# EAGLE design HumidTempSleep_Feather_001 (EAGLE 9.5.1)
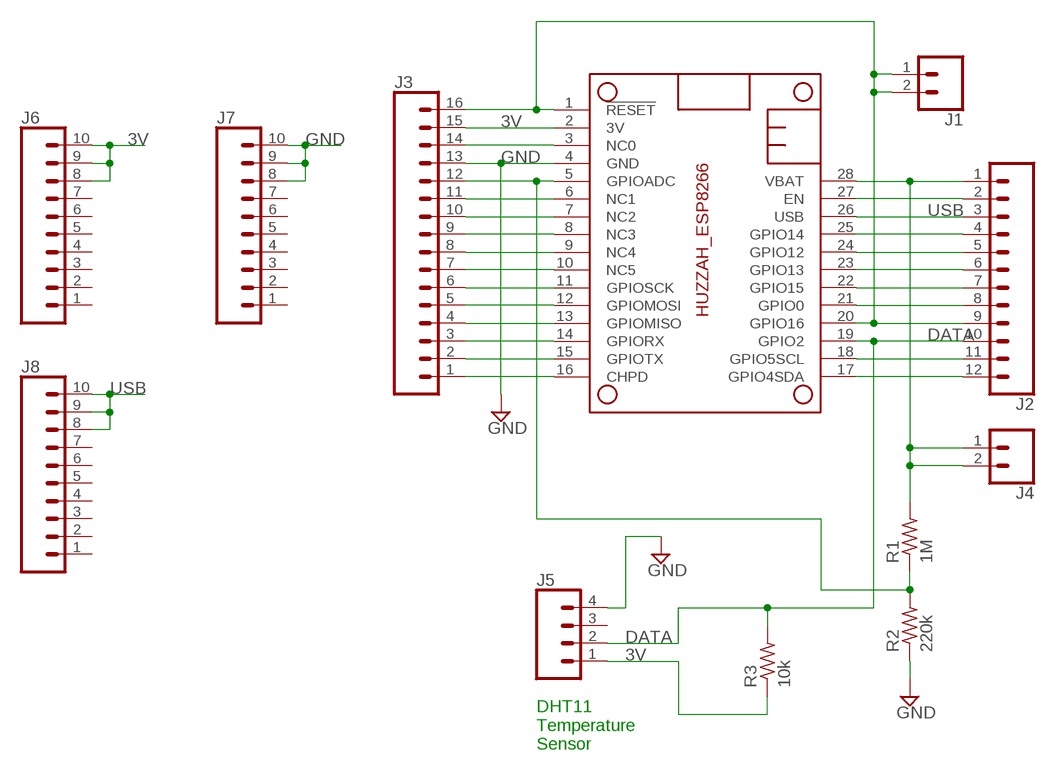
[diagram p0: schematic, sheet 1]

## Parts
J1  CONN_02  [1X02]
J2  CONN_12  [1X12]
J3  CONN_16  [1X16]
J4  CONN_02  [1X02]
J5  CONN_04PTH  [1X04]
J6  CONN_10"  [1X10]
J7  CONN_10"  [1X10]
J8  CONN_10"  [1X10]
MS2  FEATHERWING  [FEATHERWING]
R1  1M  R-US_R0805  [R0805]
R2  220k  R-US_R0805  [R0805]
R3  10k  R-US_R0805  [R0805]

## Nets
3V: J3.15 J5.1 J6.8 J6.9 J6.10 MS2.2(3V) R3.1
DATA: J2.10 J5.2 MS2.19(GPIO2) R3.2
GND: J3.13 J5.4 J7.8 J7.9 J7.10 MS2.4(GND) R2.1
N$1: J1.1 J1.2 J2.9 J3.16 MS2.1(!RESET) MS2.20(GPIO16)
N$2: J2.2 MS2.27(EN)
N$4: J2.4 MS2.25(GPIO14)
N$5: J2.5 MS2.24(GPIO12)
N$6: J2.6 MS2.23(GPIO13)
N$7: J2.7 MS2.22(GPIO15)
N$8: J2.8 MS2.21(GPIO0)
N$10: J2.11 MS2.18(GPIO5SCL)
N$11: J2.12 MS2.17(GPIO4SDA)
N$12: J3.14 MS2.3(NC0)
N$13: J3.11 MS2.6(NC1)
N$14: J3.10 MS2.7(NC2)
N$15: J3.9 MS2.8(NC3)
N$16: J3.8 MS2.9(NC4)
N$17: J3.7 MS2.10(NC5)
N$18: J3.6 MS2.11(GPIOSCK)
N$19: J3.5 MS2.12(GPIOMOSI)
N$20: J3.4 MS2.13(GPIOMISO)
N$21: J3.3 MS2.14(GPIORX)
N$22: J3.2 MS2.15(GPIOTX)
N$23: J3.1 MS2.16(CHPD)
N$24: J3.12 MS2.5(GPIOADC) R1.1 R2.2
USB: J2.3 J8.8 J8.9 J8.10 MS2.26(USB)
VBAT: J2.1 J4.1 J4.2 MS2.28(VBAT) R1.2
Unconnected: J5.3 J6.1 J6.2 J6.3 J6.4 J6.5 J6.6 J6.7 J7.1 J7.2 J7.3 J7.4 J7.5 J7.6 J7.7 J8.1 J8.2 J8.3 J8.4 J8.5 J8.6 J8.7

## Notes on the sheet
- DHT11
  Temperature
  Sensor

## Library data of the parts
J1 J4 = SparkFun-Connectors:CONN_02: Multi connection point. Often used as Generic Header-pin footprint for 0.1 inch spaced/style header connections On any of the 0.1 inch spaced packages, you can populate with these: Break Away Headers - Straight <https://www.sparkfun.com/products/116> (PRT-00116) Break Away Male Headers - Right Angle <https://www.sparkfun.com/products/553> (PRT-00553) Female Headers <https://www.sparkfun.com/products/115> (PRT-00115) Break Away Headers - Machine Pin <https://www.sparkfun.com/products/117> (PRT-00117) Break Away Female Headers - Swiss Machine Pin <https://www.sparkfun.com/products/743> (PRT-00743) For SCREWTERMINALS and SPRING TERMINALS visit here: Screw Terimnals on SparkFun.com <https://www.sparkfun.com/search/results?term=Screw+Terminals> (5mm/3.5mm/2.54mm spacing) This device is also useful as a general connection point to wire up your design to another part of your project. Our various solder wires solder well into these plated through hole pads. Hook-Up Wire - Assortment (Stranded, 22 AWG) <https://www.sparkfun.com/products/11375> (PRT-11375) Hook-Up Wire - Assortment (Solid Core, 22 AWG) <https://www.sparkfun.com/products/11367> (PRT-11367) View the entire wire category on our website here <https://www.sparkfun.com/categories/141> Special notes: Molex polarized connector foot print use with: PRT-08233 with associated crimp pins and housings. 2.54_SCREWTERM for use with PRT-10571. 3.5mm Screw Terminal footprints for PRT-08084 5mm Screw Terminal footprints for use with PRT-08432
J2 = SparkFun-Connectors:CONN_12: Multi connection point. Often used as Generic Header-pin footprint for 0.1 inch spaced/style header connections On any of the 0.1 inch spaced packages, you can populate with these: Break Away Headers - Straight <https://www.sparkfun.com/products/116> (PRT-00116) Break Away Male Headers - Right Angle <https://www.sparkfun.com/products/553> (PRT-00553) Female Headers <https://www.sparkfun.com/products/115> (PRT-00115) Break Away Headers - Machine Pin <https://www.sparkfun.com/products/117> (PRT-00117) Break Away Female Headers - Swiss Machine Pin <https://www.sparkfun.com/products/743> (PRT-00743) For SCREWTERMINALS and SPRING TERMINALS visit here: Screw Terimnals on SparkFun.com <https://www.sparkfun.com/search/results?term=Screw+Terminals> (5mm/3.5mm/2.54mm spacing) This device is also useful as a general connection point to wire up your design to another part of your project. Our various solder wires solder well into these plated through hole pads. Hook-Up Wire - Assortment (Stranded, 22 AWG) <https://www.sparkfun.com/products/11375> (PRT-11375) Hook-Up Wire - Assortment (Solid Core, 22 AWG) <https://www.sparkfun.com/products/11367> (PRT-11367) View the entire wire category on our website here <https://www.sparkfun.com/categories/141> Special notes: Molex polarized connector foot print use with SKU : PRT-08231 with associated crimp pins and housings. 1MM SMD Version SKU: PRT-10208 NOTES ON THE VARIANTS LOCK and LOCK_LONGPADS... This footprint was designed to help hold the alignment of a through-hole component (i.e. 6-pin header) while soldering it into place. You may notice that each hole has been shifted either up or down by 0.005 of an inch from it's more standard position (which is a perfectly straight line). This slight alteration caused the pins (the squares in the middle) to touch the edges of the holes. Because they are alternating, it causes a "brace" to hold the component in place. 0.005 has proven to be the perfect amount of "off-center" position when using our standard breakaway headers. Although looks a little odd when you look at the bare footprint, once you have a header in there, the alteration is very hard to notice. Also,if you push a header all the way into place, it is covered up entirely on the bottom side.
J3 = SparkFun-Connectors:CONN_16: Multi connection point. Often used as Generic Header-pin footprint for 0.1 inch spaced/style header connections On any of the 0.1 inch spaced packages, you can populate with these: Break Away Headers - Straight <https://www.sparkfun.com/products/116> (PRT-00116) Break Away Male Headers - Right Angle <https://www.sparkfun.com/products/553> (PRT-00553) Female Headers <https://www.sparkfun.com/products/115> (PRT-00115) Break Away Headers - Machine Pin <https://www.sparkfun.com/products/117> (PRT-00117) Break Away Female Headers - Swiss Machine Pin <https://www.sparkfun.com/products/743> (PRT-00743) For SCREWTERMINALS and SPRING TERMINALS visit here: Screw Terimnals on SparkFun.com <https://www.sparkfun.com/search/results?term=Screw+Terminals> (5mm/3.5mm/2.54mm spacing) This device is also useful as a general connection point to wire up your design to another part of your project. Our various solder wires solder well into these plated through hole pads. Hook-Up Wire - Assortment (Stranded, 22 AWG) <https://www.sparkfun.com/products/11375> (PRT-11375) Hook-Up Wire - Assortment (Solid Core, 22 AWG) <https://www.sparkfun.com/products/11367> (PRT-11367) View the entire wire category on our website here <https://www.sparkfun.com/categories/141> Special notes: Molex polarized connector foot print use with SKU : PRT-08231 with associated crimp pins and housings. 1MM SMD Version SKU: PRT-10208 NOTES ON THE VARIANTS LOCK and LOCK_LONGPADS... This footprint was designed to help hold the alignment of a through-hole component (i.e. 6-pin header) while soldering it into place. You may notice that each hole has been shifted either up or down by 0.005 of an inch from it's more standard position (which is a perfectly straight line). This slight alteration caused the pins (the squares in the middle) to touch the edges of the holes. Because they are alternating, it causes a "brace" to hold the component in place. 0.005 has proven to be the perfect amount of "off-center" position when using our standard breakaway headers. Although looks a little odd when you look at the bare footprint, once you have a header in there, the alteration is very hard to notice. Also,if you push a header all the way into place, it is covered up entirely on the bottom side.
J5 = SparkFun-Connectors:CONN_04: Multi connection point. Often used as Generic Header-pin footprint for 0.1 inch spaced/style header connections On any of the 0.1 inch spaced packages, you can populate with these: Break Away Headers - Straight <https://www.sparkfun.com/products/116> (PRT-00116) Break Away Male Headers - Right Angle <https://www.sparkfun.com/products/553> (PRT-00553) Female Headers <https://www.sparkfun.com/products/115> (PRT-00115) Break Away Headers - Machine Pin <https://www.sparkfun.com/products/117> (PRT-00117) Break Away Female Headers - Swiss Machine Pin <https://www.sparkfun.com/products/743> (PRT-00743) For SCREWTERMINALS and SPRING TERMINALS visit here: Screw Terimnals on SparkFun.com <https://www.sparkfun.com/search/results?term=Screw+Terminals> (5mm/3.5mm/2.54mm spacing) This device is also useful as a general connection point to wire up your design to another part of your project. Our various solder wires solder well into these plated through hole pads. Hook-Up Wire - Assortment (Stranded, 22 AWG) <https://www.sparkfun.com/products/11375> (PRT-11375) Hook-Up Wire - Assortment (Solid Core, 22 AWG) <https://www.sparkfun.com/products/11367> (PRT-11367) View the entire wire category on our website here <https://www.sparkfun.com/categories/141> Special notes: Molex polarized connector foot print use with SKU : PRT-08231 with associated crimp pins and housings. 1MM SMD Version SKU: PRT-10208; PROD_ID: CONN-09696
J6-J8 = SparkFun-Connectors:CONN_10: Multi connection point. Often used as Generic Header-pin footprint for 0.1 inch spaced/style header connections On any of the 0.1 inch spaced packages, you can populate with these: Break Away Headers - Straight <https://www.sparkfun.com/products/116> (PRT-00116) Break Away Male Headers - Right Angle <https://www.sparkfun.com/products/553> (PRT-00553) Female Headers <https://www.sparkfun.com/products/115> (PRT-00115) Break Away Headers - Machine Pin <https://www.sparkfun.com/products/117> (PRT-00117) Break Away Female Headers - Swiss Machine Pin <https://www.sparkfun.com/products/743> (PRT-00743) Arduino Stackable Header - 10 Pin <https://www.sparkfun.com/products/11376> (PRT-11376) For SCREWTERMINALS and SPRING TERMINALS visit here: Screw Terimnals on SparkFun.com <https://www.sparkfun.com/search/results?term=Screw+Terminals> (5mm/3.5mm/2.54mm spacing) This device is also useful as a general connection point to wire up your design to another part of your project. Our various solder wires solder well into these plated through hole pads. Hook-Up Wire - Assortment (Stranded, 22 AWG) <https://www.sparkfun.com/products/11375> (PRT-11375) Hook-Up Wire - Assortment (Solid Core, 22 AWG) <https://www.sparkfun.com/products/11367> (PRT-11367) View the entire wire category on our website here <https://www.sparkfun.com/categories/141> Special notes: Molex polarized connector foot print use with SKU : PRT-08231 with associated crimp pins and housings. 1MM SMD Version SKU: PRT-10208 NOTES ON THE VARIANTS LOCK and LOCK_LONGPADS... This footprint was designed to help hold the alignment of a through-hole component (i.e. 6-pin header) while soldering it into place. You may notice that each hole has been shifted either up or down by 0.005 of an inch from it's more standard position (which is a perfectly straight line). This slight alteration caused the pins (the squares in the middle) to touch the edges of the holes. Because they are alternating, it causes a "brace" to hold the component in place. 0.005 has proven to be the perfect amount of "off-center" position when using our standard breakaway headers. Although looks a little odd when you look at the bare footprint, once you have a header in there, the alteration is very hard to notice. Also,if you push a header all the way into place, it is covered up entirely on the bottom side.; PROD_ID: CONN-11563
MS2 = BlinkertonLabs:FEATHERWING
R1-R3 = adafruit:R-US_: RESISTOR, American symbol

## Board
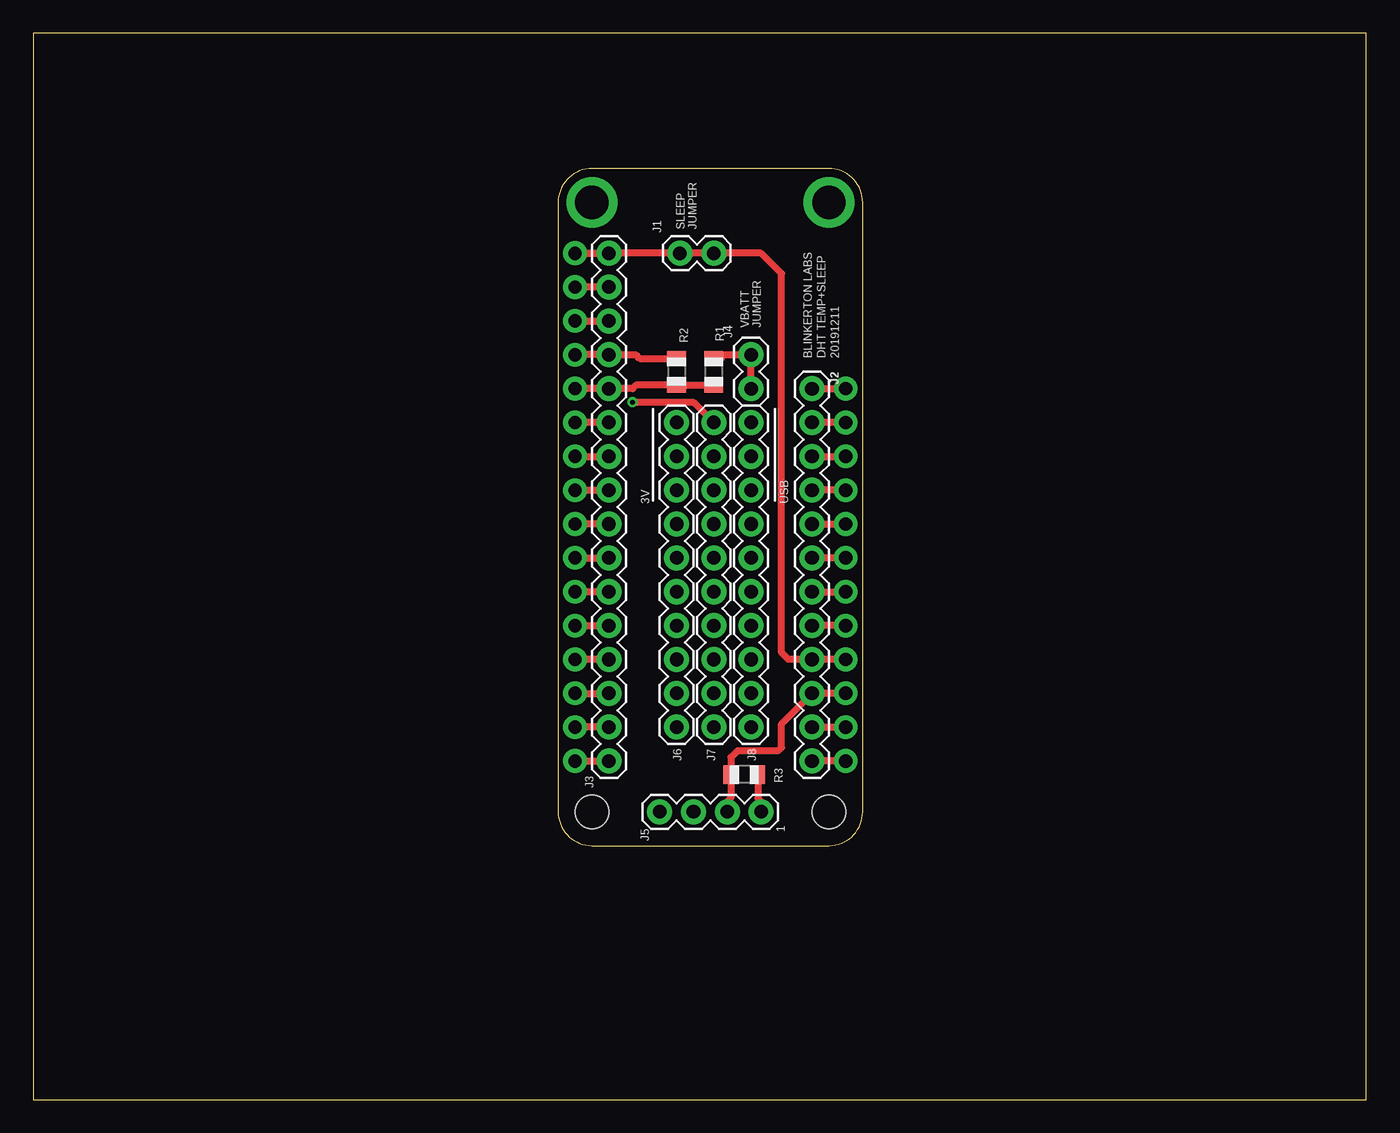
[diagram p1: board, top side]
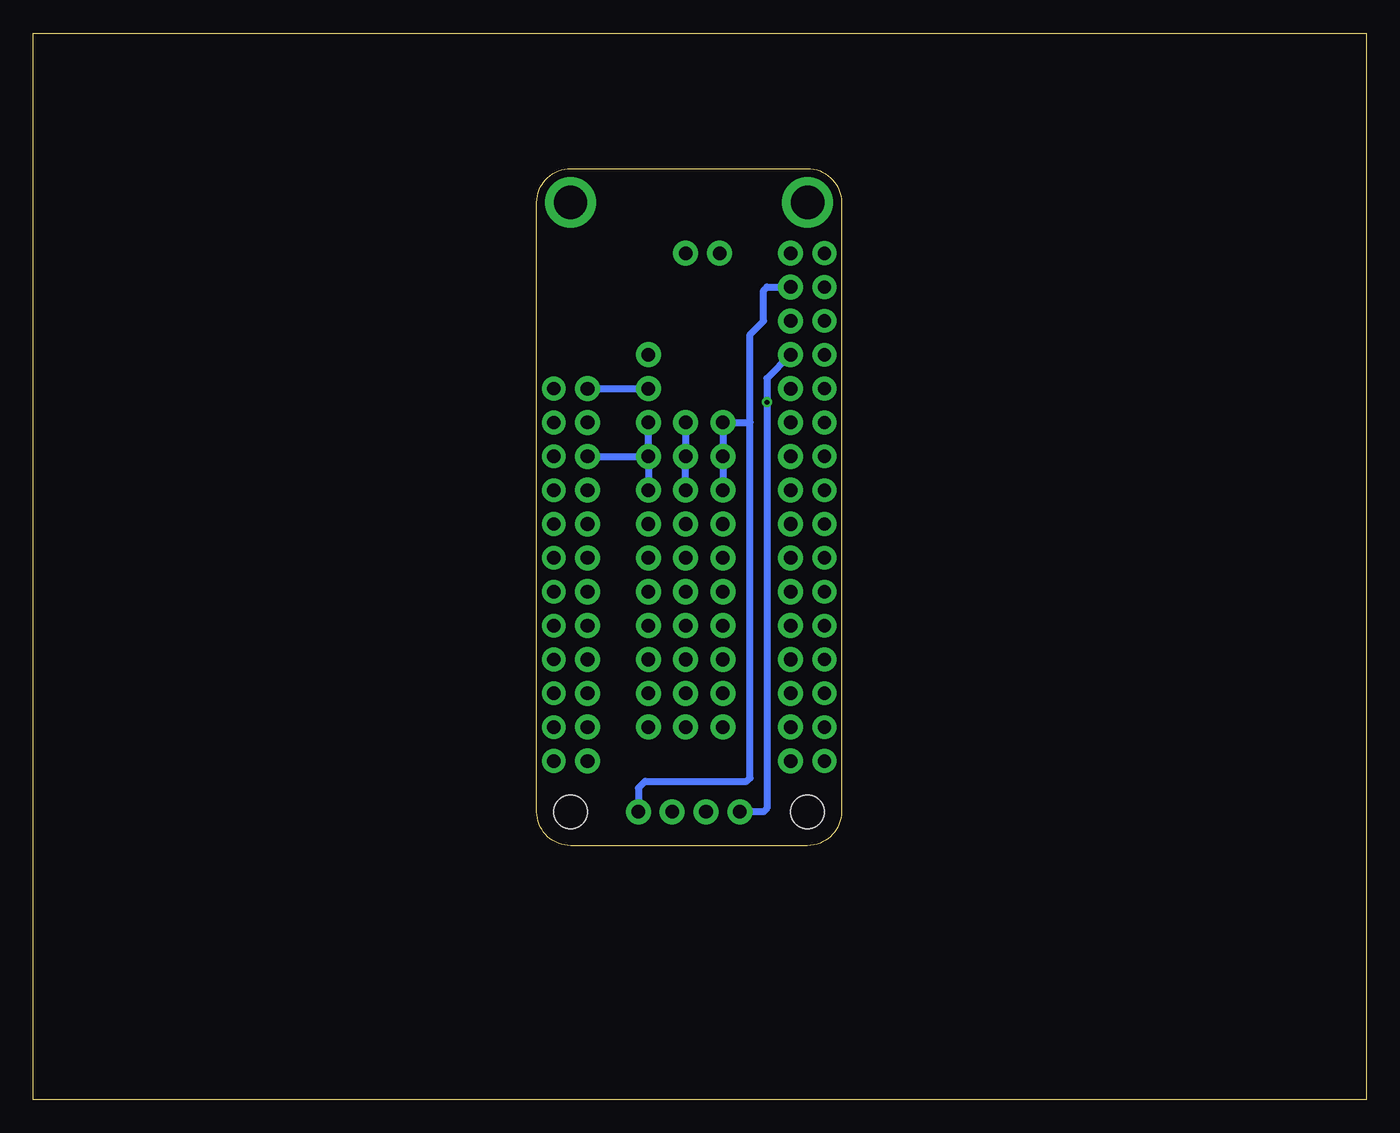
[diagram p2: board, bottom side, seen from below]

Size 100 x 80 mm. Coordinates in mm from the lower left corner, seen from the top.
Outline: 0,0 100,0 100,80 0,80 0,0
Copper layers (1*16): Top 0.035mm / dielectric 1.5mm / Bottom 0.035mm
Design rules "default": minimum track width 6mil, minimum drill 0.35mm, track to track 6mil, track to pad 6mil, pad to pad 6mil, via to via 6mil, smd to smd 6mil, copper to edge 40mil, drill to drill 6mil, minimum pad ring 10mil, minimum via ring 8mil, stop-mask expansion 4mil, vias tented up to drill 0mil, thermal gap 10mil

### Footprints (pad centres in the part's own frame; a part is rotated, then mirrored left to right if it is on the bottom)
1X02 = drill 1.016 pad 1.88: 1 0,0; 2 2.54,0
1X12 = drill 1.016 pad 1.88: 1 0,0; 2 2.54,0; 3 5.08,0; 4 7.62,0; 5 10.16,0; 6 12.7,0; 7 15.24,0; 8 17.78,0; 9 20.32,0; 10 22.86,0; 11 25.4,0; 12 27.94,0
1X16 = drill 1.016 pad 1.88: 1 0,0; 2 2.54,0; 3 5.08,0; 4 7.62,0; 5 10.16,0; 6 12.7,0; 7 15.24,0; 8 17.78,0; 9 20.32,0; 10 22.86,0; 11 25.4,0; 12 27.94,0; 13 30.48,0; 14 33.02,0; 15 35.56,0; 16 38.1,0
1X04 = drill 1.016 pad 1.88: 1 0,0; 2 2.54,0; 3 5.08,0; 4 7.62,0
1X10 = drill 1.016 pad 1.88: 1 0,0; 2 2.54,0; 3 5.08,0; 4 7.62,0; 5 10.16,0; 6 12.7,0; 7 15.24,0; 8 17.78,0; 9 20.32,0; 10 22.86,0
FEATHERWING = drill 1 pad 1.778: 1 6.35,1.27; 2 8.89,1.27; 3 11.43,1.27; 4 13.97,1.27; 5 16.51,1.27; 6 19.05,1.27; 7 21.59,1.27; 8 24.13,1.27; 9 26.67,1.27; 10 29.21,1.27; 11 31.75,1.27; 12 34.29,1.27; 13 36.83,1.27; 14 39.37,1.27; 15 41.91,1.27; 16 44.45,1.27; 17 44.45,21.59; 18 41.91,21.59; 19 39.37,21.59; 20 36.83,21.59; 21 34.29,21.59; 22 31.75,21.59; 23 29.21,21.59; 24 26.67,21.59; 25 24.13,21.59; 26 21.59,21.59; 27 19.05,21.59; 28 16.51,21.59 | drill 2.5 pad 3.81: P$1 2.54,20.32; P$2 2.54,2.54 | hole 2.54: 48.26,20.32; 48.26,2.54
R0805 = smd 1.1 x 1.4: 1 -1,0; 2 1,0

### Placement (x,y rotation side)
J1  48.51,63.5 0 top
J2  58.42,53.34 270 top
J3  43.18,25.4 90 top
J4  53.85,53.34 90 top
J5  54.61,21.59 180 top
J6  48.26,27.94 90 top
J7  51.05,27.94 90 top
J8  53.85,27.94 90 top
MS2  39.37,69.85 270 top
R1  51.05,54.61 90 top
R2  48.26,54.61 270 top
R3  53.34,24.38 180 top

### Tracks (layer width: path | path; a pad name or v marks a point on that pad's centre or on a via)
3V
  Top 0.508: J3.15 MS2.2 | R3.1 54.36,24.37 54.36,22.61 54.61,22.35 J5.1
  Bottom 0.508: J5.1 54.61,23.37 54.1,23.88 46.48,23.88 46.23,24.13 46.23,50.8 | J3.15 44.96,60.96 45.21,60.71 45.21,58.42 46.23,57.4 46.23,50.8 | 46.23,50.8 J6.10 J6.9 J6.8
DATA
  Top 0.508: MS2.19 J2.10 56.13,28.19 56.13,26.42 55.88,26.16 52.83,26.16 52.34,25.67 R3.2 52.34,22.62 52.07,22.35 J5.2
GND  (via drill 0.35)
  Top 0.508: MS2.4 J3.13 45.21,55.88 45.48,55.61 R2.1 | v44.96,52.32 49.53,52.32 J7.10
  Bottom 0.508: J3.13 44.96,54.1 v44.96,52.32 44.96,21.84 45.21,21.59 J5.4 | J7.10 J7.9 J7.8
N$1
  Top 0.508: MS2.20 J2.9 56.64,33.02 56.13,33.53 56.13,61.98 54.61,63.5 J1.2 J1.1 J3.16 MS2.1
N$2
  Top 0.508: MS2.27 J2.2
N$4
  Top 0.508: MS2.25 J2.4
N$5
  Top 0.508: J2.5 MS2.24
N$6
  Top 0.508: MS2.23 J2.6
N$7
  Top 0.508: J2.7 MS2.22
N$8
  Top 0.508: MS2.21 J2.8
N$10
  Top 0.508: J2.11 MS2.18
N$11
  Top 0.508: MS2.17 J2.12
N$12
  Top 0.508: MS2.3 J3.14
N$13
  Top 0.508: J3.11 MS2.6
N$14
  Top 0.508: MS2.7 J3.10
N$15
  Top 0.508: MS2.8 J3.9
N$16
  Top 0.508: J3.8 MS2.9
N$17
  Top 0.508: MS2.10 J3.7
N$18
  Top 0.508: J3.6 MS2.11
N$19
  Top 0.508: MS2.12 J3.5
N$20
  Top 0.508: J3.4 MS2.13
N$21
  Top 0.508: MS2.14 J3.3
N$22
  Top 0.508: J3.2 MS2.15
N$23
  Top 0.508: MS2.16 J3.1
N$24
  Top 0.508: MS2.5 J3.12 44.96,53.34 45.21,53.59 48.24,53.59 R2.2 R1.1
USB
  Top 0.508: J2.3 MS2.26
  Bottom 0.508: J2.3 J8.9 | J8.9 J8.10 | J8.9 J8.8
VBAT
  Top 0.508: J2.1 MS2.28 | J4.1 J4.2 51.82,55.88 51.55,55.61 R1.2
  Bottom 0.508: J2.1 J4.1

### Text on the board
tNames: SLEEP / JUMPER | VBATT / JUMPER | BLINKERTON LABS | DHT TEMP+SLEEP | 20191211 | 3V | USB | 1